# Altium project WY158.PRJPCB
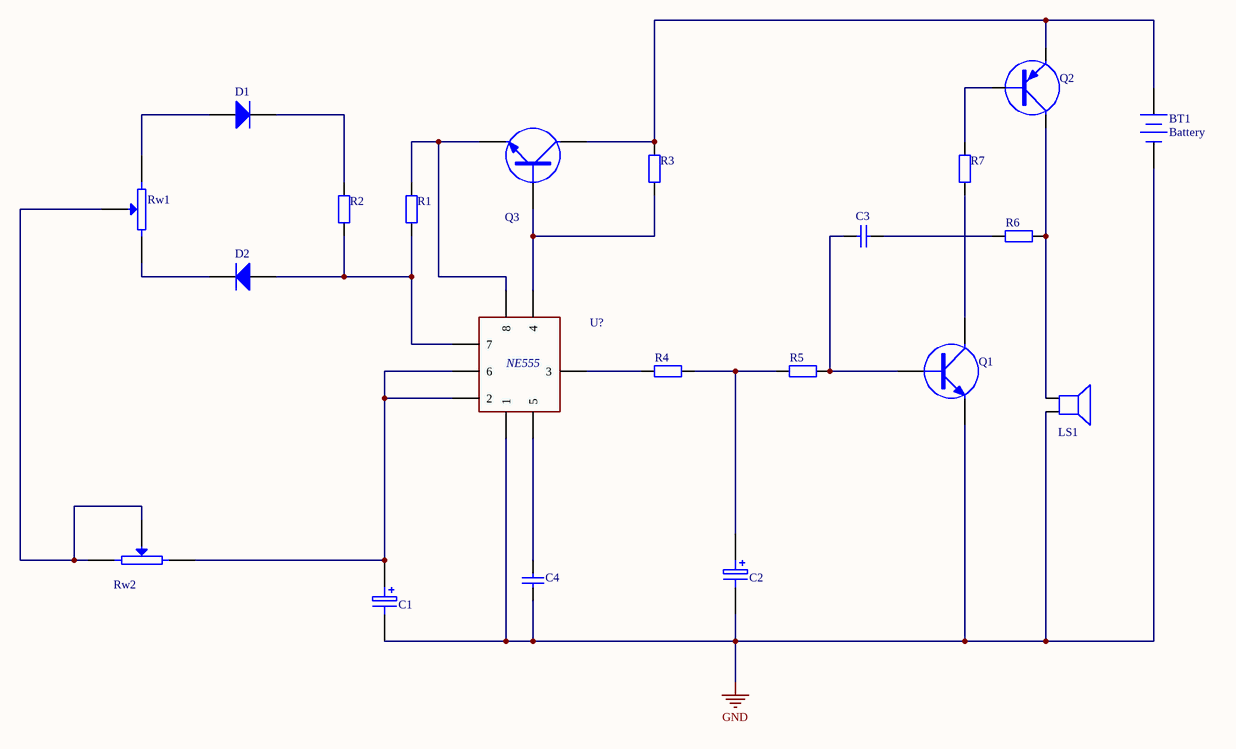
[diagram p0: Sheet1.SchDoc]
1 sheet, 21 parts. Net scope: global (net labels, ports and power ports of the same name join across sheets).
Board file: PCB1.PcbDoc

## Sheet Sheet1.SchDoc
size A4

### Parts
BT1  Battery  [BAT-2-D]
C1  C  [RAD-0.1-D]  (value not drawn)
C2  C  [RAD-0.1-D]  (value not drawn)
C3  Cap  [RAD-0.2-D]  (value not drawn)
C4  Cap  [RAD-0.2-D]  (value not drawn)
D1  IN4148  [DIODE-0.3-D]  (value not drawn)
D2  IN4148  [DIODE-0.3-D]  (value not drawn)
LS1  Speaker  [SPEAKER-D]  (value not drawn)
Q1  9013  [TO-126-D]  (value not drawn)
Q2  9012  [TO-126-D]  (value not drawn)
Q3  9013  [TO-126-D]  (value not drawn)
R1  R0.25w  [AXIAL-0.4-D]  (value not drawn)
R2  R0.25w  [AXIAL-0.4-D]  (value not drawn)
R3  R0.25w  [AXIAL-0.4-D]  (value not drawn)
R4  R0.25w  [AXIAL-0.4-D]  (value not drawn)
R5  R0.25w  [AXIAL-0.4-D]  (value not drawn)
R6  R0.25w  [AXIAL-0.4-D]  (value not drawn)
R7  R0.25w  [AXIAL-0.4-D]  (value not drawn)
Rw1  Rw  [VR6-D]  (value not drawn)
Rw2  Rw  [VR6-D]  (value not drawn)
U?  555  [DIP-8-D]  (value not drawn)

### Nets
GND: BT1.2(-) C1.2 C2.2 C4.1 LS1.2 Q1.1(E) U?.1
NetBT1_1: BT1.1(+) Q2.1(E) Q3.3(C) R3.2
NetC1_1: C1.1 Rw2.3 U?.2 U?.6
NetC2_1: C2.1 R4.2 R5.1
NetC3_1: C3.1 R6.1
NetC3_2: C3.2 Q1.2(B) R5.2
NetC4_2: C4.2 U?.5
NetD1_1: D1.1(A) Rw1.3
NetD1_2: D1.2(K) R2.2
NetD2_1: D2.1(A) R1.1 R2.1 U?.7
NetD2_2: D2.2(K) Rw1.1
NetLS1_1: LS1.1 Q2.3(C) R6.2
NetQ1_3: Q1.3(C) R7.1
NetQ2_2: Q2.2(B) R7.2
NetQ3_1: Q3.1(E) R1.2 U?.8
NetQ3_2: Q3.2(B) R3.1 U?.4
NetR4_1: R4.1 U?.3
NetRw1_2: Rw1.2 Rw2.1 Rw2.2

### Library data of the parts
BT1 = Battery: Multicell Battery; Published: 24-Mar-1999; LatestRevisionDate: 17-Jul-2002; LatestRevisionNote: Re-released for DXP Platform.; PackageReference: BAT-2; Publisher: Altium Limited
C1 C2 = C: Electrolytic Capacitor
C3 C4 = Cap: Capacitor; Value: 100pF; Published: 8-Jun-2000; LatestRevisionDate: 17-Jul-2002; LatestRevisionNote: Re-released for DXP Platform.; PackageReference: RAD-0.3; Publisher: Altium Limited
D1 D2 = IN4148: Default Diode; Published: 8-Jun-2000; LatestRevisionDate: 17-Jul-2002; LatestRevisionNote: Re-released for DXP Platform.; PackageDocument: Sep-1996; PackageReference: SMC; Publisher: Altium Limited; Code_JEDEC: DO-214-AB
LS1 = Speaker: Loudspeaker; Published: 24-Mar-1999; LatestRevisionDate: 17-Jul-2002; LatestRevisionNote: Re-released for DXP Platform.; PackageReference: PIN2; Publisher: Altium Limited
Q1 Q3 = 9013: NPN Transistor
R1-R7 = R0.25w: Resistor; Value: 1K; Published: 8-Jun-2000; LatestRevisionDate: 17-Jul-2002; LatestRevisionNote: Re-released for DXP Platform.; PackageReference: AXIAL-0.4; Publisher: Altium Limited
Rw1 Rw2 = Rw: Potentiometer
U? = NE555